# EAGLE design Smartwatch-BASIC-TOP (EAGLE 9.6.2)
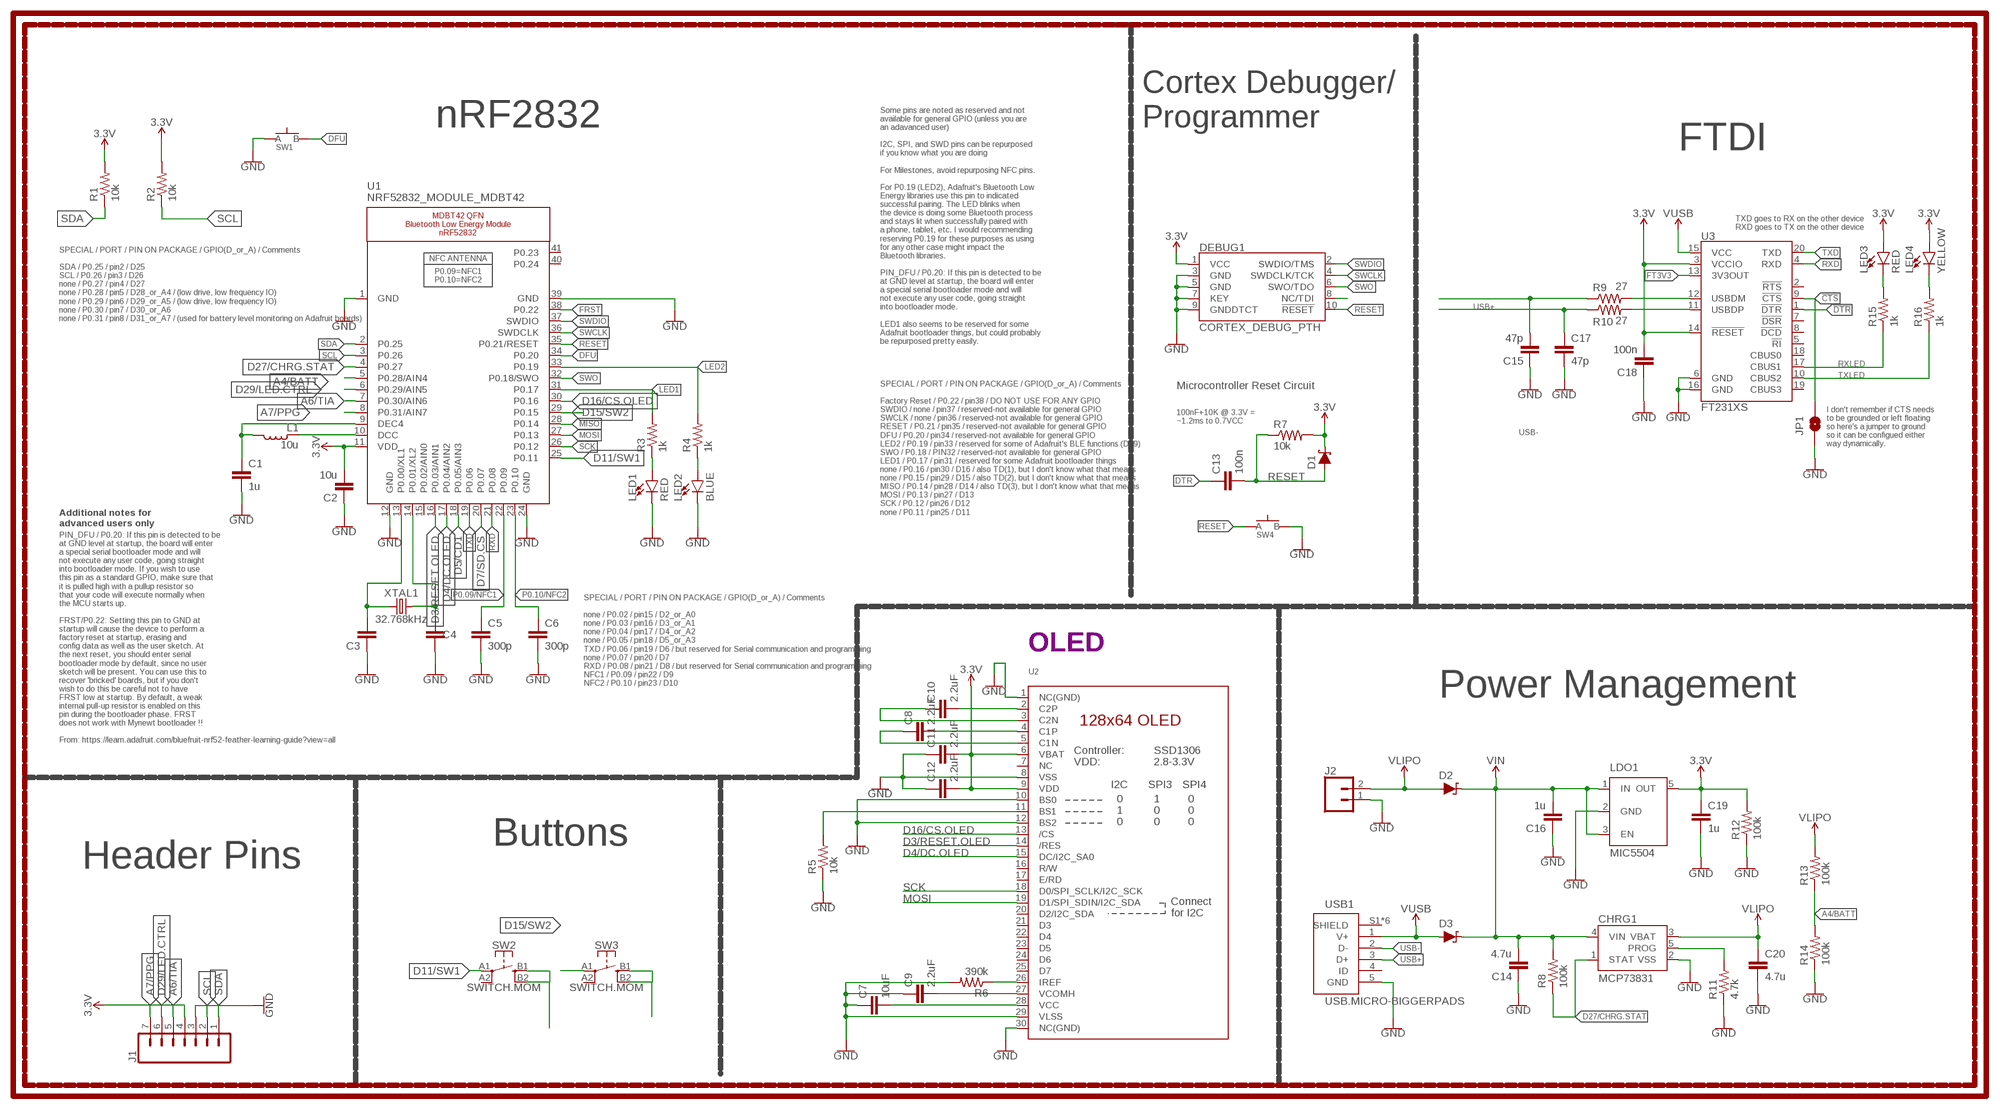
[diagram p0: schematic, sheet 1]

## Parts
C1  1u  CAPACITOR0603  [C0603]
C2  10u  CAPACITOR0805  [C0805]
C3  CAPACITOR0603  [C0603]
C4  CAPACITOR0603  [C0603]
C5  300p  CAPACITOR0603  [C0603]
C6  300p  CAPACITOR0603  [C0603]
C7  10uF  CAPACITOR0603  [C0603]
C8  2.2uF  CAPACITOR0402  [C0402]
C9  2.2uF  CAPACITOR0402  [C0402]
C10  2.2uF  CAPACITOR0402  [C0402]
C11  2.2uF  CAPACITOR0402  [C0402]
C12  2.2uF  CAPACITOR0402  [C0402]
C13  100n  CAPACITOR0603  [C0603]
C14  4.7u  CAPACITOR0603  [C0603]
C15  47p  CAPACITOR0603  [C0603]
C16  1u  CAPACITOR0603  [C0603]
C17  47p  CAPACITOR0603  [C0603]
C18  100n  CAPACITOR0603  [C0603]
C19  1u  CAPACITOR0603  [C0603]
C20  4.7u  CAPACITOR0603  [C0603]
CHRG1  MCP73831  [SOT23-5]
D1  SCHOTTKY-USC  [USC]
D2  SCHOTTKY-USC  [USC]
D3  SCHOTTKY-USC  [USC]
DEBUG1  CORTEX_DEBUG_PTH  [2X5-PTH-1.27MM]
J1  CONN_07-1.27MM  [1X07_1.27MM]
J2  CONN_02  [1X02]
JP1  JUMPER-SMT_2_NO_SILK  [SMT-JUMPER_2_NO_SILK]
L1  10u  INDUCTOR0603  [L0603]
LDO1  MIC5504  [SOT23-5]
LED1  RED  LED0603  [LED-0603]
LED2  BLUE  LED0603  [LED-0603]
LED3  RED  LED0603  [LED-0603]
LED4  YELLOW  LED0603  [LED-0603]
R1  10k  RESISTOR0603  [R0603]
R2  10k  RESISTOR0603  [R0603]
R3  1k  RESISTOR0603  [R0603]
R4  1k  RESISTOR0603  [R0603]
R5  10k  RESISTOR0603  [R0603]
R6  390k  RESISTOR0603  [R0603]
R7  10k  RESISTOR0603  [R0603]
R8  100k  RESISTOR0603  [R0603]
R9  27  RESISTOR0603  [R0603]
R10  27  RESISTOR0603  [R0603]
R11  4.7k  RESISTOR0603  [R0603]
R12  100k  RESISTOR0603  [R0603]
R13  100k  RESISTOR0603  [R0603]
R14  100k  RESISTOR0603  [R0603]
R15  1k  RESISTOR0603  [R0603]
R16  1k  RESISTOR0603  [R0603]
SW1  SPST-PTS830GG140-COPY.1-3  [BUTTON-GULLWING]
SW2  SWITCH.MOM  [TACTILE_SWITCH_SMD_6.2MM_TALL]
SW3  SWITCH.MOM  [TACTILE_SWITCH_SMD_6.2MM_TALL]
SW4  SPST-PTS830GG140-COPY.1-3  [BUTTON-GULLWING]
U1  NRF52832_MODULE_MDBT42  [BLE_MODULE_RAYTAC_MDBT42]
U2  DISP_OLED_UG-2864HSWEG01-NO-WRAPAROUND  [UG-2864HSWEG01_0.96IN_NO-WRAPAROUND]
U3  FT231XS  [SSOP20_L]
USB1  USB.MICRO-BIGGERPADS  [USB-MICRO-01.BIGGERPADS]
XTAL1  32.768kHz  CRYSTALECS-.327-12.5-12-C-TR  [2-SMD.NOLEAD.2.0MMTO1.2MM]

## Nets
3.3V: C2.2 C11.2 C12.2 C18.2 C19.1 D1.-(C) DEBUG1.1(VCC) J1.4 LDO1.5(OUT) LED3.A LED4.A R1.2 R2.2 R7.2 R12.2 U1.11(VDD) U2.6(VBAT) U2.9(VDD) U3.3(VCCIO) U3.14(!RESET)
!CTS: JP1.2 U3.9(!CTS)
!DTR: U3.1(!DTR)
A4/BATT: R13.1 R14.2 U1.5(P0.28/AIN4)
A6/TIA: J1.5 U1.7(P0.30/AIN6)
A7/PPG: J1.7 U1.8(P0.31/AIN7)
D3/RESET.OLED: U1.16(P0.03/AIN1) U2.14(/RES)
D4/DC.OLED: U1.17(P0.04/AIN2) U2.15(DC/I2C_SA0)
D5/CD1: U1.18(P0.05/AIN3)
D7/SD.CS: U1.20(P0.07)
D11/SW1: SW2.A1 U1.25(P0.11)
D15/SW2: SW3.A1 U1.29(P0.15)
D16/CS.OLED: U1.30(P0.16) U2.13(/CS)
D27/CHRG.STAT: CHRG1.1(STAT) R8.1 U1.4(P0.27)
D29/LED.CTRL: J1.6 U1.6(P0.29/AIN5)
DFU: SW1.3(B) U1.34(P0.20)
DTR: C13.1
FRST: U1.38(P0.22)
FT3V3: U3.13(3V3OUT)
GND: C1.2 C2.1 C3.1 C4.2 C5.2 C6.2 C7.1 C9.1 C11.1 C12.1 C14.1 C15.1 C16.1 C17.2 C18.1 C19.2 C20.2 CHRG1.2(VSS) DEBUG1.3(GND) DEBUG1.5(GND) DEBUG1.7(KEY) DEBUG1.9(GNDDTCT) J1.3 J2.1 JP1.1 LDO1.2(GND) LED1.C LED2.C R5.1 R6.2 R11.1 R12.1 R14.1 SW1.1(A) SW4.3(B) U1.1(GND) U1.12(GND) U1.24(GND) U1.39(GND) U2.1(NC(GND)) U2.8(VSS) U2.10(BS0) U2.12(BS2) U2.29(VLSS) U2.30(NC(GND)) U3.6(GND) U3.16(GND) USB1.5(GND)
LED1: R3.2 U1.31(P0.17)
LED2: R4.2 U1.33(P0.19)
MISO: U1.28(P0.14)
MOSI: U1.27(P0.13) U2.19(D1/SPI_SDIN/I2C_SDA)
N$1: R5.2 U2.11(BS1)
N$2: R6.1 U2.26(IREF)
N$3: C10.2 U2.2(C2P)
N$4: C3.2 U1.13(P0.00/XL1) XTAL1.P$1
N$5: C10.1 U2.3(C2N)
N$6: C4.1 U1.14(P0.01/XL2) XTAL1.P$2
N$7: C8.2 U2.4(C1P)
N$8: C8.1 U2.5(C1N)
N$9: LED1.A R3.1
N$10: LED2.A R4.1
N$11: L1.1 U1.10(DCC)
N$12: C1.1 L1.2 U1.9(DEC4)
N$13: C7.2 U2.28(VCC)
N$14: DEBUG1.8(NC/TDI)
N$15: C9.2 U2.27(VCOMH)
N$16: CHRG1.5(PROG) R11.2
N$21: SW2.B1 SW2.B2
N$22: SW3.B1 SW3.B2
N$25: R9.2 U3.12(USBDM)
N$26: R10.2 U3.11(USBDP)
N$27: LED3.C R15.2
N$28: LED4.C R16.2
P0.09/NFC1: C5.1 U1.22(P0.09)
P0.10/NFC2: C6.1 U1.23(P0.10)
RESET: C13.2 D1.+(A) DEBUG1.10(!RESET) R7.1 SW4.1(A) U1.35(P0.21/RESET)
RXD: U1.21(P0.08) U3.4(RXD)
RXLED: R15.1 U3.17(CBUS1)
SCK: U1.26(P0.12) U2.18(D0/SPI_SCLK/I2C_SCK)
SCL: J1.2 R2.1 U1.3(P0.26)
SDA: J1.1 R1.1 U1.2(P0.25)
SWCLK: DEBUG1.4(SWDCLK/TCK) U1.36(SWDCLK)
SWDIO: DEBUG1.2(SWDIO/TMS) U1.37(SWDIO)
SWO: DEBUG1.6(SWO/TDO) U1.32(P0.18/SWO)
TXD: U1.19(P0.06) U3.20(TXD)
TXLED: R16.1 U3.10(CBUS2)
USB+: C17.1 R10.1 USB1.3(D+)
USB-: C15.2 R9.1 USB1.2(D-)
V_USB: D3.+(A) U3.15(VCC) USB1.1(V+) ; supply symbol labelled VUSB
VIN: C14.2 C16.2 CHRG1.4(VIN) D2.-(C) D3.-(C) LDO1.1(IN) LDO1.3(EN) R8.2
VLIPO: C20.1 CHRG1.3(VBAT) D2.+(A) J2.2 R13.2
Unconnected: SW2.A2 SW3.A2 U1.15(P0.02/AIN0) U1.40(P0.24) U1.41(P0.23) U2.7(NC) U2.16(R/W) U2.17(E/RD) U2.20(D2/I2C_SDA) U2.21(D3) U2.22(D4) U2.23(D5) U2.24(D6) U2.25(D7) U3.2(!RTS) U3.5(!RI) U3.7(!DSR) U3.8(!DCD) U3.18(CBUS0) U3.19(CBUS3) USB1.4(ID) USB1.S1(SHIELD) USB1.S2(SHIELD) USB1.S3(SHIELD) USB1.S4(SHIELD) USB1.S5(SHIELD) USB1.S6(SHIELD)

## Notes on the sheet
- nRF2832
- Cortex Debugger/
  Programmer
- FTDI
- TXD goes to RX on the other device
  RXD goes to TX on the other device
- SPECIAL / PORT / PIN ON PACKAGE / GPIO(D_or_A) / Comments
  
  SDA / P0.25 / pin2 / D25
  SCL / P0.26 / pin3 / D26
  none / P0.27 / pin4 / D27
  none / P0.28 / pin5 / D28_or_A4 / (low drive, low frequency IO)
  none / P0.29 / pin6 / D29_or_A5 / (low drive, low frequency IO)
  none / P0.30 / pin7 / D30_or_A6
  none / P0.31 / pin8 / D31_or_A7 / (used for battery level monitoring on Adafruit boards)
- Some pins are noted as reserved and not
  available for general GPIO (unless you are
  an adavanced user)
  
  I2C, SPI, and SWD pins can be repurposed
  if you know what you are doing
  
  For Milestones, avoid repurposing NFC pins.
  
  For P0.19 (LED2), Adafruit's Bluetooth Low
  Energy libraries use this pin to indicated
  successful pairing. The LED blinks when
  the device is doing some Bluetooth process
  and stays lit when successfully paired with
  a phone, tablet, etc. I would recommending
  reserving P0.19 for these purposes as using
  for any other case might impact the
  Bluetooth libraries.
  
  PIN_DFU / P0.20: If this pin is detected to be
  at GND level at startup, the board will enter
  a special serial bootloader mode and will
  not execute any user code, going straight
  into bootloader mode.
  
  LED1 also seems to be reserved for some
  Adafruit bootloader things, but could probably
  be repurposed pretty easily.
- Microcontroller Reset Circuit
- 100nF+10K @ 3.3V =
  ~1.2ms to 0.7VCC
- I don't remember if CTS needs
  to be grounded or left floating
  so here's a jumper to ground
  so it can be configued either
  way dynamically.
- SPECIAL / PORT / PIN ON PACKAGE / GPIO(D_or_A) / Comments
  
  Factory Reset / P0.22 / pin38 / DO NOT USE FOR ANY GPIO
  SWDIO / none / pin37 / reserved-not available for general GPIO
  SWCLK / none / pin36 / reserved-not available for general GPIO
  RESET / P0.21 / pin35 / reserved-not available for general GPIO
  DFU / P0.20 / pin34 / reserved-not available for general GPIO
  LED2 / P0.19 / pin33 / reserved for some of Adafruit's BLE functions (D19)
  SWO / P0.18 / PIN32 / reserved-not available for general GPIO
  LED1 / P0.17 / pin31 / reserved for some Adafruit bootloader things
  none / P0.16 / pin30 / D16 / also TD(1), but I don't know what that means
  none / P0.15 / pin29 / D15 / also TD(2), but I don't know what that means
  MISO / P0.14 / pin28 / D14 / also TD(3), but I don't know what that means
  MOSI / P0.13 / pin27 / D13
  SCK / P0.12 / pin26 / D12
  none / P0.11 / pin25 / D11
- Additional notes for
  advanced users only
- OLED
- SPECIAL / PORT / PIN ON PACKAGE / GPIO(D_or_A) / Comments
  
  none / P0.02 / pin15 / D2_or_A0
  none / P0.03 / pin16 / D3_or_A1
  none / P0.04 / pin17 / D4_or_A2
  none / P0.05 / pin18 / D5_or_A3
  TXD / P0.06 / pin19 / D6 / but reserved for Serial communication and programming
  none / P0.07 / pin20 / D7
  RXD / P0.08 / pin21 / D8 / but reserved for Serial communication and programming
  NFC1 / P0.09 / pin22 / D9
  NFC2 / P0.10 / pin23 / D10
- Power Management
- PIN_DFU / P0.20: If this pin is detected to be
  at GND level at startup, the board will enter
  a special serial bootloader mode and will
  not execute any user code, going straight
  into bootloader mode. If you wish to use
  this pin as a standard GPIO, make sure that
  it is pulled high with a pullup resistor so
  that your code will execute normally when
  the MCU starts up.
  
  FRST/P0.22: Setting this pin to GND at
  startup will cause the device to perform a
  factory reset at startup, erasing and
  config data as well as the user sketch. At
  the next reset, you should enter serial
  bootloader mode by default, since no user
  sketch will be present. You can use this to
  recover 'bricked' boards, but if you don't
  wish to do this be careful not to have
  FRST low at startup. By default, a weak
  internal pull-up resistor is enabled on this
  pin during the bootloader phase. FRST
  does not work with Mynewt bootloader !!
  
  From: https://learn.adafruit.com/bluefruit-nrf52-feather-learning-guide?view=all
- Buttons
- Header Pins

## Library data of the parts
C1-C20 = LinnesLab-Passives:CAPACITOR
CHRG1 = LinnesLab-Power:MCP73831: MCP73831T Li-Ion, Li-Pol Controller Miniature single cell, fully integrated Li-Ion, Li-polymer charge management controller Datasheet <http://ww1.microchip.com/downloads/en/DeviceDoc/20001984g.pdf> SparkFun Products: SparkFun ESP32 Thing <https://www.sparkfun.com/products/13907> SparkFun 9DoF Razor IMU M0 <https://www.sparkfun.com/products/14001>; PROD_ID: IC-09995
D1-D3 = LinnesLab-DiscreteSemi:SCHOTTKY: Schottky diode A Schottky diode is a semiconductor diode which has a low forward voltage drop and a very fast switching action. Example: Digi-Key Part Number: RB161MM-20CT-ND
DEBUG1 = LinnesLab-Connectors:CORTEX_DEBUG: Cortex Debug Connector - 10 pin Supports JTAG debug, Serial Wire debug, and Serial Wire Viewer. PTH and SMD connector options available. General Connector Information <http://infocenter.arm.com/help/topic/com.arm.doc.faqs/attached/13634/cortex_debug_connectors.pdf> Products: PTH Connector <http://www.digikey.com/product-detail/en/cnc-tech/3220-10-0100-00/1175-1627-ND/3883661> -via Digi-Key SparkFun PSoc <https://www.sparkfun.com/products/13229> SparkFun T <https://www.sparkfun.com/products/13810>
J1 = LinnesLab-Connectors:CONN_07: Multi connection point. Often used as Generic Header-pin footprint for 0.1 inch spaced/style header connections On any of the 0.1 inch spaced packages, you can populate with these: Break Away Headers - Straight <https://www.sparkfun.com/products/116> (PRT-00116) Break Away Male Headers - Right Angle <https://www.sparkfun.com/products/553> (PRT-00553) Female Headers <https://www.sparkfun.com/products/115> (PRT-00115) Break Away Headers - Machine Pin <https://www.sparkfun.com/products/117> (PRT-00117) Break Away Female Headers - Swiss Machine Pin <https://www.sparkfun.com/products/743> (PRT-00743) For SCREWTERMINALS and SPRING TERMINALS visit here: Screw Terimnals on SparkFun.com <https://www.sparkfun.com/search/results?term=Screw+Terminals> (5mm/3.5mm/2.54mm spacing) This device is also useful as a general connection point to wire up your design to another part of your project. Our various solder wires solder well into these plated through hole pads. Hook-Up Wire - Assortment (Stranded, 22 AWG) <https://www.sparkfun.com/products/11375> (PRT-11375) Hook-Up Wire - Assortment (Solid Core, 22 AWG) <https://www.sparkfun.com/products/11367> (PRT-11367) View the entire wire category on our website here <https://www.sparkfun.com/categories/141> Special notes: Molex polarized connector foot print use with SKU : PRT-08231 with associated crimp pins and housings. 1MM SMD Version SKU: PRT-10208 NOTES ON THE VARIANTS LOCK and LOCK_LONGPADS... This footprint was designed to help hold the alignment of a through-hole component (i.e. 6-pin header) while soldering it into place. You may notice that each hole has been shifted either up or down by 0.005 of an inch from it's more standard position (which is a perfectly straight line). This slight alteration caused the pins (the squares in the middle) to touch the edges of the holes. Because they are alternating, it causes a "brace" to hold the component in place. 0.005 has proven to be the perfect amount of "off-center" position when using our standard breakaway headers. Although looks a little odd when you look at the bare footprint, once you have a header in there, the alteration is very hard to notice. Also,if you push a header all the way into place, it is covered up entirely on the bottom side.
J2 = LinnesLab-Connectors:CONN_02: Multi connection point. Often used as Generic Header-pin footprint for 0.1 inch spaced/style header connections On any of the 0.1 inch spaced packages, you can populate with these: Break Away Headers - Straight <https://www.sparkfun.com/products/116> (PRT-00116) Break Away Male Headers - Right Angle <https://www.sparkfun.com/products/553> (PRT-00553) Female Headers <https://www.sparkfun.com/products/115> (PRT-00115) Break Away Headers - Machine Pin <https://www.sparkfun.com/products/117> (PRT-00117) Break Away Female Headers - Swiss Machine Pin <https://www.sparkfun.com/products/743> (PRT-00743) For SCREWTERMINALS and SPRING TERMINALS visit here: Screw Terimnals on SparkFun.com <https://www.sparkfun.com/search/results?term=Screw+Terminals> (5mm/3.5mm/2.54mm spacing) This device is also useful as a general connection point to wire up your design to another part of your project. Our various solder wires solder well into these plated through hole pads. Hook-Up Wire - Assortment (Stranded, 22 AWG) <https://www.sparkfun.com/products/11375> (PRT-11375) Hook-Up Wire - Assortment (Solid Core, 22 AWG) <https://www.sparkfun.com/products/11367> (PRT-11367) View the entire wire category on our website here <https://www.sparkfun.com/categories/141> Special notes: Molex polarized connector foot print use with: PRT-08233 with associated crimp pins and housings. 2.54_SCREWTERM for use with PRT-10571. 3.5mm Screw Terminal footprints for PRT-08084 5mm Screw Terminal footprints for use with PRT-08432
JP1 = LinnesLab-Switches:JUMPER-SMT_2_NO: Normally open jumper This jumper has two pads in close proximity to each other. Apply solder to close the connection. Round pads are easier to solder for beginners, but are a lot larger. SparkFun Product that uses the round pads: SparkFun EL Sequencer <https://www.sparkfun.com/products/12781>
L1 = LinnesLab-Passives:INDUCTOR
LDO1 = LinnesLab-Power:MIC5504: MIC5504 Voltage Regulator Output Voltages: 1.0V to 3.3V Input Voltages: 2.5V to 5.5V Link to Datasheet http://ww1.microchip.com/downloads/en/DeviceDoc/MIC550X.pdf
LED1-LED4 = LinnesLab-LED:LED: LED (Generic) Standard schematic elements and footprints for 5mm, 3mm, 1206, and 0603 sized LEDs. Generic LEDs with no color specified. LTST-C190KGKT: arrow indicates cathode
R1-R16 = LinnesLab-Passives:RESISTOR
SW1 SW4 = LinnesLab-Switches:SPST-PTS830GG140-COPY
SW2 SW3 = LinnesLab-Switches:SWITCH.MOM: PTS645SM43SMTR92 LFS
U1 = LinnesLab-Microcontrollers:NRF52832_MODULE_MDBT42: MDBT42 - BLE Module (nRF52832 QFN) VDD: 1.7-3.6V
U2 = LinnesLab-Displays:DISP_OLED_UG-2864HSWEG01: UG-2864HSWEG01 OLED display Both 1.3" and 0.96" models share the same FPC tab footprint, only the screen dimensions vary.
U3 = LinnesLab-DigitalIC:FT231X: FTDI FT231X Full Speed USB to Full-handshake UART This USB2.0 Full Speed IC offers a compact bridge to full handshake UART interfaces. The device is a UART, capable of operating up to 3MBaud, with low power consumption (8mA). The FT231X includes the complete FT-X series feature set and enables USB to be added into a system design quickly and easily over a UART interface. Datasheet <http://cdn.sparkfun.com/datasheets/Components/General%20IC/DS_FT231X.pdf>; DIGIKEY: 768-1156-5-ND; MFN: FT231XS-U
USB1 = LinnesLab-Connectors:USB.MICRO: DigiKey PN: 609-4613-1-ND
XTAL1 = LinnesLab-Clocks:CRYSTAL; DIGIKEY: XC2288CT-ND; FREQ: 32.7680KHZ; LOAD_CAP: 12.5pF

## Board
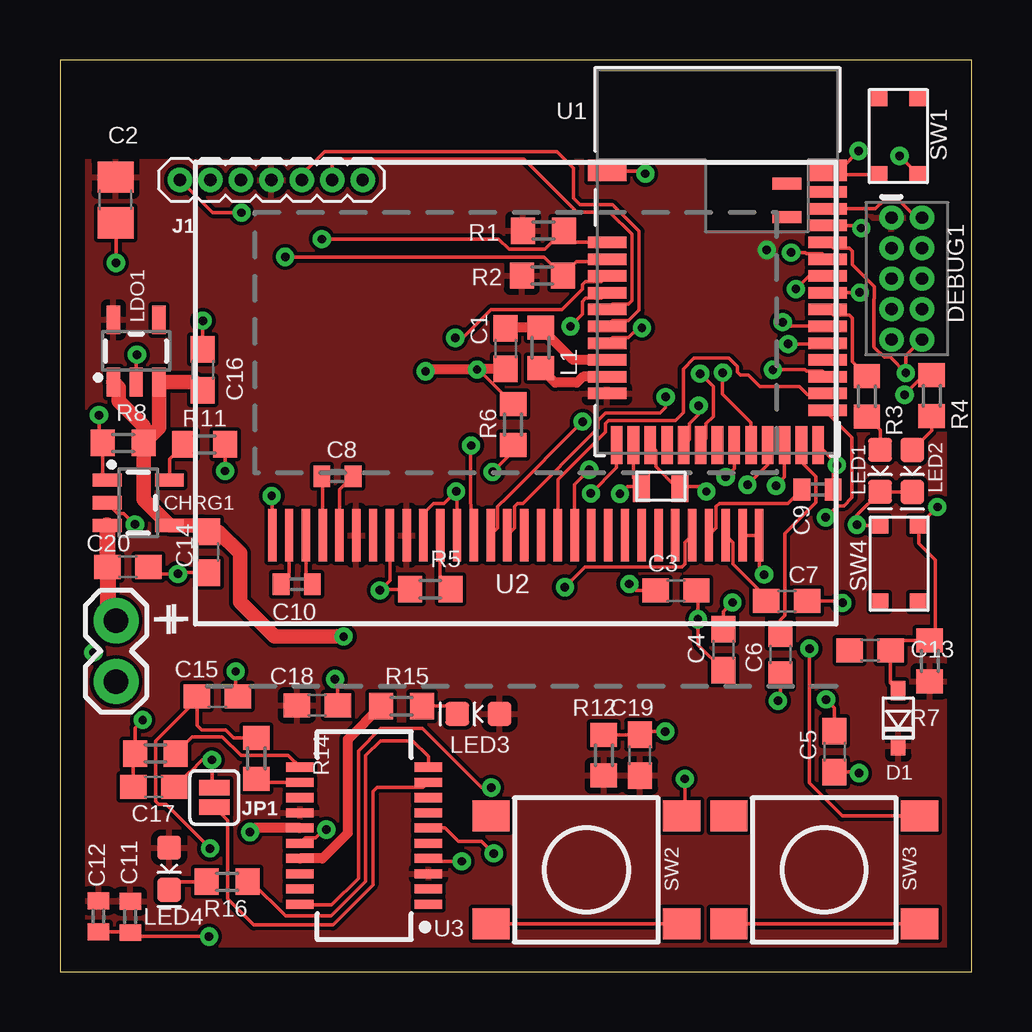
[diagram p1: board, top side]
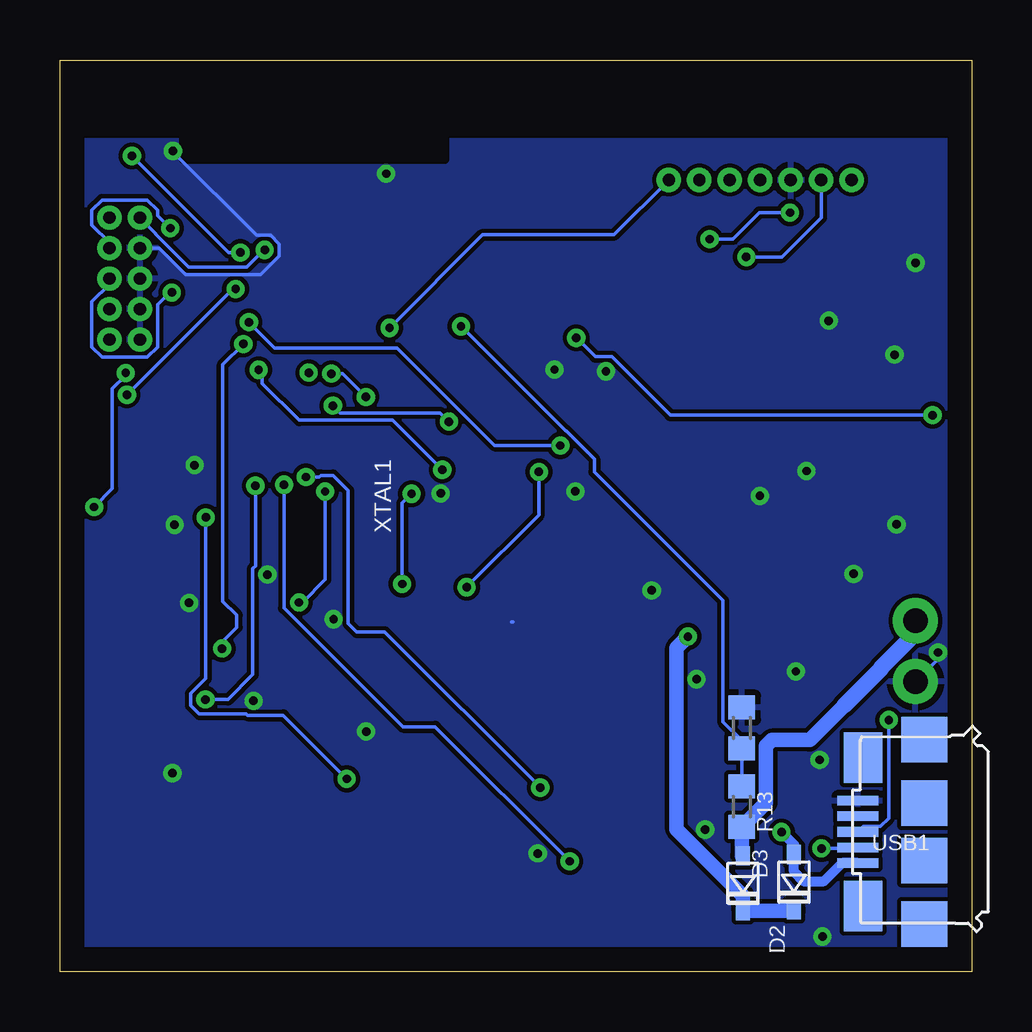
[diagram p2: board, bottom side, seen from below]

Size 38 x 38 mm. Coordinates in mm from the lower left corner, seen from the top.
Outline: 0,0 38,0 38,38 0,38 0,0
Copper layers (1*16): Top 0.035mm / dielectric 1.5mm / Bottom 0.035mm
Design rules "default": minimum track width 6mil, minimum drill 0.35mm, track to track 6mil, track to pad 6mil, pad to pad 6mil, via to via 6mil, smd to smd 6mil, copper to edge 40mil, drill to drill 6mil, minimum pad ring 10mil, minimum via ring 8mil, stop-mask expansion 4mil, vias tented up to drill 0mil, thermal gap 10mil

### Footprints (pad centres in the part's own frame; a part is rotated, then mirrored left to right if it is on the bottom)
C0603 = smd 1.1 x 1: 1 -0.85,0; 2 0.85,0
C0805 = smd 1.3 x 1.5: 1 -0.95,0; 2 0.95,0
C0402 = smd 0.7 x 0.9: 1 -0.65,0; 2 0.65,0
SOT23-5 = smd 0.55 x 1.2: 1 -0.95,-1.3; 2 0,-1.3; 3 0.95,-1.3; 4 0.95,1.3; 5 -0.95,1.3
USC = smd 0.8 x 0.6: + -1.15,0; - 1.15,0
2X5-PTH-1.27MM = drill 0.508 pad 1: 1 -2.54,-0.635; 2 -2.54,0.635; 3 -1.27,-0.635; 4 -1.27,0.635; 5 0,-0.635; 6 0,0.635; 7 1.27,-0.635; 8 1.27,0.635; 9 2.54,-0.635; 10 2.54,0.635
1X07_1.27MM = drill 0.508 pad 1: 1 0,0; 2 1.27,0; 3 2.54,0; 4 3.81,0; 5 5.08,0; 6 6.35,0; 7 7.62,0
1X02 = drill 1.016 pad 1.88: 1 0,0; 2 2.54,0
SMT-JUMPER_2_NO_SILK = smd 0.635 x 1.27: 1 -0.406,0; 2 0.406,0
L0603 = smd 1 x 1.1: 1 -0.85,0; 2 0.85,0
LED-0603 = smd 1 x 1: A -0.877,0; C 0.877,0
R0603 = smd 1 x 1.1: 1 -0.85,0; 2 0.85,0
BUTTON-GULLWING = smd 0.7 x 0.75: 1 -1.6,0.825; 2 1.6,0.825; 3 -1.6,-0.825; 4 1.6,-0.825
TACTILE_SWITCH_SMD_6.2MM_TALL = smd 1.55 x 1.3: A1 -3.975,-2.25; A2 3.975,-2.25; B1 -3.975,2.25; B2 3.975,2.25
BLE_MODULE_RAYTAC_MDBT42 = smd 1.6 x 0.9: 1 -4.6,3.8; 39 4.6,3.8 | smd 1.6 x 0.48: 2 -4.6,0.8; 3 -4.6,0.1; 4 -4.6,-0.6; 5 -4.6,-1.3; 6 -4.6,-2; 7 -4.6,-2.7; 8 -4.6,-3.4; 9 -4.6,-4.1; 10 -4.6,-4.8; 11 -4.6,-5.5; 25 4.6,-6.2; 26 4.6,-5.5; 27 4.6,-4.8; 28 4.6,-4.1; 29 4.6,-3.4; 30 4.6,-2.7; 31 4.6,-2; 32 4.6,-1.3; 33 4.6,-0.6; 34 4.6,0.1; 35 4.6,0.8; 36 4.6,1.5; 37 4.6,2.2; 38 4.6,2.9 | smd 0.48 x 1.6: 12 -4.2,-7.65; 13 -3.5,-7.65; 14 -2.8,-7.65; 15 -2.1,-7.65; 16 -1.4,-7.65; 17 -0.7,-7.65; 18 0,-7.65; 19 0.7,-7.65; 20 1.4,-7.65; 21 2.1,-7.65; 22 2.8,-7.65; 23 3.5,-7.65; 24 4.2,-7.65 | smd 1.2 x 0.5: 40 2.9,3.25; 41 2.9,1.85
UG-2864HSWEG01_0.96IN_NO-WRAPAROUND = smd 0.35 x 2.2: 1 -10.15,-1.2; 2 -9.45,-1.2; 3 -8.75,-1.2; 4 -8.05,-1.2; 5 -7.35,-1.2; 6 -6.65,-1.2; 7 -5.95,-1.2; 8 -5.25,-1.2; 9 -4.55,-1.2; 10 -3.85,-1.2; 11 -3.15,-1.2; 12 -2.45,-1.2; 13 -1.75,-1.2; 14 -1.05,-1.2; 15 -0.35,-1.2; 16 0.35,-1.2; 17 1.05,-1.2; 18 1.75,-1.2; 19 2.45,-1.2; 20 3.15,-1.2; 21 3.85,-1.2; 22 4.55,-1.2; 23 5.25,-1.2; 24 5.95,-1.2; 25 6.65,-1.2; 26 7.35,-1.2; 27 8.05,-1.2; 28 8.75,-1.2; 29 9.45,-1.2; 30 10.15,-1.2
SSOP20_L = smd 0.381 x 1.143: 1 -2.857,-2.68; 2 -2.223,-2.68; 3 -1.587,-2.68; 4 -0.953,-2.68; 5 -0.318,-2.68; 6 0.318,-2.68; 7 0.953,-2.68; 8 1.587,-2.68; 9 2.223,-2.68; 10 2.857,-2.68; 11 2.857,2.68; 12 2.223,2.68; 13 1.587,2.68; 14 0.953,2.68; 15 0.318,2.68; 16 -0.318,2.68; 17 -0.953,2.68; 18 -1.587,2.68; 19 -2.223,2.68; 20 -2.857,2.68
USB-MICRO-01.BIGGERPADS = smd 0.4 x 1.7: 1 -1.3,1.505; 2 -0.65,1.505; 3 0,1.505; 4 0.65,1.505; 5 1.3,1.505 | smd 1.9 x 1.9: S1 -3.85,-1.27; S2 -1.2,-1.27; S3 1.2,-1.27; S4 3.85,-1.27 | smd 2.1 x 1.6: S5 -3.1,1.28; S6 3.1,1.28
2-SMD.NOLEAD.2.0MMTO1.2MM = smd 0.7 x 1.3: P$1 -0.8,0; P$2 0.8,0

### Placement (x,y rotation side)
C1  18.57,25.97 270 top
C2  2.32,32.16 90 top
C3  25.68,15.89 180 top
C4  27.65,13.42 270 top
C5  32.28,9.17 270 top
C6  30.02,13.22 270 top
C7  30.3,15.45 180 top
C8  11.57,20.65 180 top
C9  31.58,20.09 180 top
C10  9.87,16.15 180 top
C11  2.93,2.28 90 top
C12  1.61,2.3 90 top
C13  33.77,13.39 0 top
C14  6.17,17.48 90 top
C15  6.56,11.46 180 top
C16  5.95,25.09 270 top
C17  3.91,7.69 0 top
C18  10.73,11.1 180 top
C19  24.18,9.02 90 top
C20  2.83,16.86 0 top
CHRG1  3.26,19.55 270 top
D1  34.94,10.56 270 top
D2  9.53,3.68 270 bottom
D3  7.4,3.73 270 bottom
DEBUG1  35.3,28.89 270 top
J1  5,33 0 top
J2  2.34,12.09 90 top
JP1  6.43,7.26 270 top
L1  20.04,26 90 top
LDO1  3.17,25.87 0 top
LED1  34.19,20.88 270 top
LED2  35.53,20.87 270 top
LED3  17.44,10.74 180 top
LED4  4.55,4.29 270 top
R1  20.15,30.88 180 top
R2  20.11,29.01 180 top
R3  33.63,23.98 90 top
R4  36.34,24.01 90 top
R5  15.43,15.94 0 top
R6  18.89,22.8 90 top
R7  36.26,12.95 270 top
R8  2.64,22.04 0 top
R9  8.19,8.88 270 top
R10  3.98,9.09 0 top
R11  6.03,21.97 180 top
R12  22.67,9.02 270 top
R13  9.58,6.88 270 bottom
R14  9.58,10.15 270 bottom
R15  14.24,11.06 0 top
R16  6.97,3.74 180 top
SW1  34.95,34.83 90 top
SW2  21.94,4.24 180 top
SW3  31.86,4.24 180 top
SW4  34.98,17 270 top
U1  27.41,29.6 0 top
U2  19,19.39 0 top
U3  12.68,5.66 90 top
USB1  3.24,5.82 90 bottom
XTAL1  25.04,20.23 0 top

### Tracks (layer width: path | path; a pad name or v marks a point on that pad's centre or on a via)
3.3V  (via drill 0.35)
  Bottom 0.152: DEBUG1.1 34.01,30.77 34.01,30.74 32.64,29.36 30.23,29.36 29.51,30.08 v29.47,30.08
  pour Top: 1,33.8 37.42,33.8 37.42,1 1,1
!CTS
  Top 0.152: U3.9 15.14,7.67 13.21,7.67 13.05,7.51 13.05,3.62 11.38,1.94 8.08,1.94 6.99,3.04 6.99,6.29 JP1.2
A4/BATT  (via drill 0.35)
  Top 0.152: U1.5 22.57,28.07 21.91,28.07 21.78,27.93 21.78,27.4 v21.28,26.9
  Bottom 0.152: R13.1 9.58,9.18 R14.2 9.58,9.63 10.36,10.41 10.36,15.47 15.72,20.83 15.72,21.36 16.89,22.54 16.92,22.54 v21.28,26.9
A6/TIA
  Top 0.152: U1.7 23.04,27.13 23.7,27.13 24.14,27.57 24.14,30.86 23.03,31.97 21.68,31.97 21.41,32.24 21.41,33.48 20.72,34.17 11.02,34.17 10.08,33.23 J1.5
A7/PPG  (via drill 0.35)
  Top 0.152: U1.8 23.04,26.43 23.7,26.43 24.1,26.83 v24.26,26.83
  Bottom 0.152: v24.26,26.83 20.38,30.71 14.91,30.71 J1.7
D3/RESET.OLED  (via drill 0.35)
  Top 0.152: U2.14 18.25,18.48 18.25,19.38 18.65,19.79 v21.79,22.92 | U1.16 26.24,22.18 26.24,22.84 26.63,23.23 v26.63,23.59
  Bottom 0.152: v21.79,22.92 22.15,23.29 26.33,23.29 v26.63,23.59
D4/DC.OLED  (via drill 0.35)
  Top 0.152: U2.15 18.95,18.48 18.95,19.38 19.08,19.52 19.3,19.52 22.43,22.65 22.43,22.97 22.75,23.28 25.02,23.28 25.25,23.52 v25.25,23.95 | U1.17 26.69,21.96 26.94,22.21 26.94,22.84 27.23,23.14 27.23,24.38 v26.69,24.92
  Bottom 0.152: v25.25,23.95 26.22,24.92 v26.69,24.92
D7/SD.CS  (via drill 0.35)
  Top 0.152: U1.20 28.81,22.88 27.61,24.08 27.61,24.94 v27.63,24.96
D11/SW1  (via drill 0.35)
  Top 0.152: v31.92,18.93 32.41,19.41 32.68,19.41 33.02,19.75 33.02,22.25 32.01,23.26 U1.25 | SW2.A1 26.06,6.63 26.05,6.65 v26.05,8.03
  Bottom 0.152: v31.92,18.93 31.92,12.21 32.55,11.59 32.55,11.09 32.19,10.73 30.24,10.73 30.18,10.68 28.7,10.68 v26.05,8.03
D15/SW2  (via drill 0.35)
  Top 0.152: SW3.A1 32.61,6.49 31.24,7.86 v31.24,13.46 | v30.35,26.16 31.97,26.16 U1.29
  Bottom 0.152: v31.24,13.46 31.24,13.75 30.64,14.35 30.64,14.86 31.21,15.44 31.21,25.3 v30.35,26.16
D16/CS.OLED  (via drill 0.35)
  Top 0.152: U1.30 30.3,26.9 v30.13,27.07 | v17.14,21.93 17.12,21.91 17.12,19.57 U2.13
  Bottom 0.152: v30.13,27.07 29.05,25.99 23.94,25.99 19.88,21.93 v17.14,21.93
D27/CHRG.STAT  (via drill 0.35)
  Top 0.152: CHRG1.1 1.79,20.67 R8.1 1.63,22.2 v1.63,23.2 | U1.4 22.57,28.77 21.91,28.77 21.78,28.63 21.78,28.46 20.92,27.6 17.98,27.6 16.8,26.42 v16.48,26.42
  Bottom 0.152: v16.48,26.42 15.68,25.63 14.99,25.63 12.56,23.2 v1.63,23.2
D29/LED.CTRL
  Top 0.152: U1.6 23.04,27.83 23.7,27.83 23.84,27.96 23.84,30.73 22.91,31.66 21.55,31.66 19.35,33.86 11.53,33.86 11.35,33.68 J1.6
DFU  (via drill 0.35)
  Top 0.152: SW1.3 v35,34 | v30.48,29.97 31.07,29.97 31.11,29.93 31.77,29.93 U1.34
  Bottom 0.152: v35,34 34.14,33.14 30.97,29.97 v30.48,29.97
GND  (via drill 0.35)
  Top 0.152: U2.1 8.84,19.83 v8.82,19.83 | v6.21,1.46 2.93,1.46 C11.1 2.9,1.65 C12.1 | C2.1 2.33,31.2 v2.33,29.54 | U3.6 16.06,5.98 16.61,5.43 17.57,5.43 v18.08,4.92 | U2.29 U2.30 29.15,16.75 v29.35,16.55 | U2.8 13.75,16.31 v13.34,15.89 13.38,15.94 R5.1 | U1.1 22.83,33.37 24.29,33.37 v24.4,33.26 | SW1.1 32.17,33.23 U1.39 32.51,33.4 32.93,33.81 32.93,33.85 v33.29,34.21 | R6.2 17.44,25.09 v17.39,25.09 | U1.12 23.21,21.01 v22.13,19.93 | C3.1 arc-45 26.6,15.73 v26.6,14.69 26.6,13.62 C4.2 | C6.2 30.02,11.46 29.93,11.37 v29.93,11.29 | C7.1 32.54,15.45 v32.62,15.37 | U3.16 10.22,5.56 10.67,5.56 11.02,5.92 v11.1,5.92 | CHRG1.2 2.41,19.1 2.66,19.1 3.12,18.64 v3.13,18.64 | LDO1.2 3.17,25.68 v3.21,25.71 | C20.2 3.97,16.58 v4.92,16.58 4.97,16.63 C14.1 | C18.1 11.58,12.07 v11.47,12.18 | U1.24 32.39,21.16 v32.39,21.11 32.23,20.95 C9.1 | R11.1 v6.88,20.87 | C16.1 v5.95,27.13 | v5.95,27.13 | R12.1 C19.2 24.32,10.01 v25.23,10.01 | C17.2 5.38,8.31 5.42,8.31 5.94,8.82 v6.33,8.82 6.33,7.76 JP1.1 | LED2.C LED1.C 33.22,19.03 v33.22,18.63 33.25,18.6 SW4.3 | C15.1 7.32,11.55 v7.32,12.51 | U2.10 15.15,19.08 15.58,19.52 16.01,19.52 v16.51,20.02 16.55,19.98 U2.12 | C5.2 33.27,8.32 v33.31,8.27
  Top 0.406: C1.2 17.41,25.12 v17.39,25.09 15.31,25.09 v15.24,25.02
  Bottom 0.152: 19.11,14.58 19.18,14.58 | DEBUG1.3 33.86,30.16 32.76,29.06 29.63,29.06 28.86,29.83 28.86,30.33 29.21,30.69 29.8,30.69 33.29,34.18 v33.29,34.21 | J2.1 1.39,13.03 v1.39,13.3
  pour Bottom (isolate 0.178): 0.99,34.68 0.99,0.99 37.41,0.99 37.41,34.68
LED1
  Top 0.152: R3.2 33.03,25.43 33.03,27.23 32.9,27.37 32.24,27.37 U1.31
LED2  (via drill 0.35)
  Top 0.152: R4.2 36.02,24.86 v35.21,24.04 | v30.68,28.45 31.22,29 U1.33
  Bottom 0.152: v35.21,24.04 30.8,28.45 v30.68,28.45
MOSI  (via drill 0.35)
  Top 0.152: U2.19 21.45,20.3 v22.06,20.91 | v29.72,25.08 31.06,25.08 31.11,25.03 31.77,25.03 U1.27
  Bottom 0.152: v29.72,25.08 29.56,24.93 29.56,24.51 28.03,22.98 24.13,22.98 v22.06,20.91
N$1
  Top 0.152: R5.2 15.85,16.37 U2.11
N$2  (via drill 0.35)
  Top 0.152: v21.05,16.02 21.88,16.86 25.92,16.86 26.05,16.99 26.05,17.89 U2.26 | v18.03,20.83 18.89,21.68 R6.1
  Bottom 0.152: v21.05,16.02 18.03,19.04 v18.03,20.83
N$3
  Top 0.152: U2.2 9.55,16.47 C10.2
N$4  (via drill 0.35)
  Top 0.152: U1.13 23.91,20.56 XTAL1.P$1 23.65,20.23 v23.34,19.92 | C3.2 24.01,15.89 v23.74,16.16
  Bottom 0.152: v23.34,19.92 23.74,19.53 v23.74,16.16
N$5
  Top 0.152: U2.3 10.25,16.42 C10.1
N$6  (via drill 0.35)
  Top 0.152: v28.03,15.39 27.65,15 C4.1 | v26.95,20.01 26.73,20.23 XTAL1.P$2 25.65,20.23 24.84,21.04 24.84,21.72 U1.14
  Bottom 0.152: v28.03,15.39 27.89,15.39 26.95,16.34 v26.95,20.01
N$7
  Top 0.152: U2.4 10.95,20.62 C8.2
N$8
  Top 0.152: U2.5 11.65,20.09 C8.1
N$9
  Top 0.152: R3.1 34.19,22.58 LED1.A
N$10
  Top 0.152: R4.1 36.34,22.56 LED2.A
N$11
  Top 0.406: U1.10 21.81,24.8 21.55,24.54 20.64,24.54 L1.1
N$12
  Top 0.406: U1.9 21.39,25.5 L1.2 18.6,26.85 C1.1
N$13
  Top 0.152: U2.28 28.05,17.89 28.05,16.99 29.45,15.59 C7.2
N$15
  Top 0.152: U2.27 27.35,18.48 27.35,19.38 27.48,19.52 30.35,19.52 C9.2
N$16
  Top 0.152: CHRG1.5 4.56,21.36 R11.2
N$21
  Top 0.152: SW2.B2 SW2.B1
N$22
  Top 0.152: SW3.B2 SW3.B1
N$25
  Top 0.152: U3.12 8.33,7.89 R9.2
N$26
  Top 0.152: R10.2 5.52,9.78 6.77,9.78 7.54,9.01 9.52,9.01 U3.11
N$27
  Top 0.152: R15.2 16.24,11.06 LED3.C
N$28
  Top 0.152: R16.2 4.89,3.74 LED4.C
P0.09/NFC1  (via drill 0.35)
  Top 0.152: U1.22 30.21,20.61 v29.85,20.25 | v31.94,11.34 32.28,11 C5.1
  Bottom 0.152: v29.85,20.25 29.85,16.9 29.96,16.8 29.96,12.38 31,11.34 v31.94,11.34
P0.10/NFC2
  Top 0.152: C6.1 30.02,14.65 30.22,14.85 30.22,18.26 31.51,19.55 31.51,20.64 30.91,21.24 U1.23
RESET  (via drill 0.35)
  Top 0.152: v36.58,19.36 v36.57,19.36 SW4.1 35.81,17.84 36.49,17.16 36.49,14.03 R7.1 35.02,13.8 C13.2 34.62,12.03 D1.+ | U1.35 32.24,30.17 32.9,30.17 33.03,30.03 33.03,29.47 33.94,28.56 33.94,28.05 33.93,28.04 33.93,26.04 34.36,25.61 34.6,25.61 v35.26,24.95 35.26,25.67 DEBUG1.10
  Bottom 0.152: v35.26,24.95 35.26,24.85 35.81,24.3 35.81,20.13 v36.58,19.36
RXD  (via drill 0.35)
  Top 0.152: U1.21 29.51,21.14 v28.66,20.29 | v16.75,4.59 15.48,4.59 U3.4
  Bottom 0.152: v16.75,4.59 22.36,10.2 23.71,10.2 28.66,15.16 v28.66,20.29
RXLED
  Top 0.406: U3.17 10.94,4.71 12.01,5.78 12.01,9.68 R15.1
SCK
  Top 0.152: U1.26 31.96,24.05 31.16,24.05 30.83,24.38 29.18,24.38 28.7,24.86 28.37,24.86 28.24,25 28.24,25.21 27.88,25.57 26.43,25.57 25.98,25.12 25.98,23.3 25.65,22.98 22.87,22.98 22.74,22.84 22.74,22.49 20.75,20.5 U2.18
SCL  (via drill 0.35)
  Top 0.152: U1.3 22.7,29.59 21.54,29.59 R2.1 20.18,29.79 v9.39,29.79
  Bottom 0.152: v9.39,29.79 7.9,29.79 6.27,31.42 J1.2
SDA  (via drill 0.35)
  Top 0.152: U1.2 21.49,30.4 R1.1 20.23,30.11 18.71,30.11 18.28,30.53 v10.92,30.53 | v7.57,31.64 6.36,31.64 J1.1
  Bottom 0.152: v7.57,31.64 8.84,31.64 9.95,30.53 v10.92,30.53
SWCLK  (via drill 0.35)
  Top 0.152: U1.36 33.29,31.1 v33.4,30.99
  Bottom 0.152: v33.4,30.99 33.93,31.52 33.93,31.73 34.36,32.16 36.24,32.16 36.67,31.73 36.67,31.12 35.94,30.38 DEBUG1.4
SWDIO
  Top 0.152: DEBUG1.2 35.71,31.43 34.97,32.16 34.36,32.16 34,31.8 U1.37
SWO  (via drill 0.35)
  Top 0.152: v33.34,28.31 33.33,28.3 U1.32
  Bottom 0.152: DEBUG1.6 35.94,28.66 36.67,27.92 36.67,26.04 36.24,25.61 34.36,25.61 33.93,26.04 33.93,27.8 33.43,28.31 v33.34,28.31
TXD  (via drill 0.35)
  Top 0.152: U1.19 28.11,20.97 v27.75,20.62 | v17.98,7.67 17.58,7.67 15.12,10.13 13.37,10.13 12.44,9.2 12.44,3.88 11.33,2.77 10.04,2.77 U3.20
  Bottom 0.152: v27.75,20.62 27.19,20.62 27.12,20.68 26.62,20.68 25.99,20.05 25.99,14.51 25.63,14.16 24.47,14.16 v17.98,7.67
TXLED
  Top 0.152: R16.1 7.98,3.74 9.41,2.31 11.3,2.31 12.75,3.76 12.75,9.01 13.36,9.62 14.7,9.62 15.36,8.96 U3.10
USB+  (via drill 0.35)
  Top 0.152: C17.1 3.06,9.02 R10.1 3.13,10.16 v3.45,10.48
  Bottom 0.152: USB1.3 4.52,6.04 3.8,6.04 3.45,6.39 v3.45,10.48
USB-  (via drill 0.35)
  Top 0.152: R9.1 7.24,9.73 6.9,10.08 5.9,10.08 5.71,10.27 C15.2 5.71,11.34 3.98,9.61 3.98,7.1 4.12,6.96 4.42,6.96 v6.26,5.13
  Bottom 0.152: v6.26,5.13 4.79,5.13 USB1.2
V_USB  (via drill 0.35)
  Top 0.406: U3.15 8.09,5.98 v7.92,5.81
  Bottom 0.406: USB1.1 5.39,4.52 6.15,3.77 7,3.77 7.41,4.17 D3.+ 7.41,5.3 v7.92,5.81
VIN  (via drill 0.35)
  Top 0.61: R8.2 3.49,19.67 CHRG1.4 5.91,18.59 C14.2 6.62,18.33 7.51,17.44 7.51,15.4 8.94,13.96 v11.82,13.96 | R8.2 4.12,22.68 LDO1.3 5.62,24.57 C16.2 | LDO1.1 2.44,24.35 2.44,23.78 3.49,22.74 R8.2
  Bottom 0.61: D3.- 7.41,2.53 D2.- 9.53,3.16 12.3,5.93 12.3,13.49 v11.82,13.96
VLIPO
  Top 0.66: CHRG1.3 1.99,18.57 C20.1 1.99,14.98 J2.2
  Bottom 0.61: D2.+ 9.58,4.83 R13.2 8.57,7.04 8.57,9.4 8.32,9.65 6.75,9.65 5.3,11.1
  Bottom 0.66: 5.3,11.1 3.76,12.63 3.76,12.68 2.34,14.1 J2.2

### Text on the board
_tNames: + | +